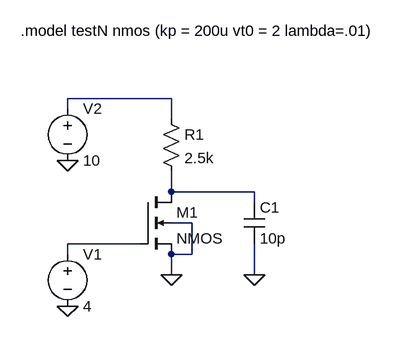
[diagram p0: schematic Draft2.asc]
Draft2.asc, the LTspice schematic file:
Version 4
SHEET 1 880 680
WIRE 176 -80 16 -80
WIRE 16 -64 16 -80
WIRE 176 -48 176 -80
WIRE 176 64 176 32
WIRE 304 64 176 64
WIRE 304 80 304 64
WIRE 208 112 176 112
WIRE 128 144 16 144
WIRE 16 160 16 144
WIRE 208 160 208 112
WIRE 208 160 176 160
WIRE 176 192 176 160
WIRE 304 192 304 144
FLAG 176 192 0
FLAG 304 192 0
FLAG 16 16 0
FLAG 16 240 0
SYMBOL nmos4 128 64 R0
SYMATTR InstName M1
SYMBOL res 160 -64 R0
SYMATTR InstName R1
SYMATTR Value 2.5k
SYMBOL cap 288 80 R0
SYMATTR InstName C1
SYMATTR Value 10p
SYMBOL voltage 16 144 R0
WINDOW 123 0 0 Left 0
WINDOW 39 0 0 Left 0
SYMATTR InstName V1
SYMATTR Value 4
SYMBOL voltage 16 -80 R0
WINDOW 123 0 0 Left 0
WINDOW 39 0 0 Left 0
SYMATTR InstName V2
SYMATTR Value 10
TEXT -56 -184 Left 2 !.model testN nmos (kp = 200u vt0 = 2 lambda=.01)

The netlist it stands for:
* Draft2.asc
M1 N002 N003 0 0 NMOS
R1 N001 N002 2.5k
C1 N002 0 10p
V1 N003 0 4
V2 N001 0 10
.model NMOS NMOS
.model PMOS PMOS
.lib standard.mos
.model testN nmos (kp = 200u vt0 = 2 lambda=.01)
.backanno
.end